# Altium project PCB-PRO.PrjPcb
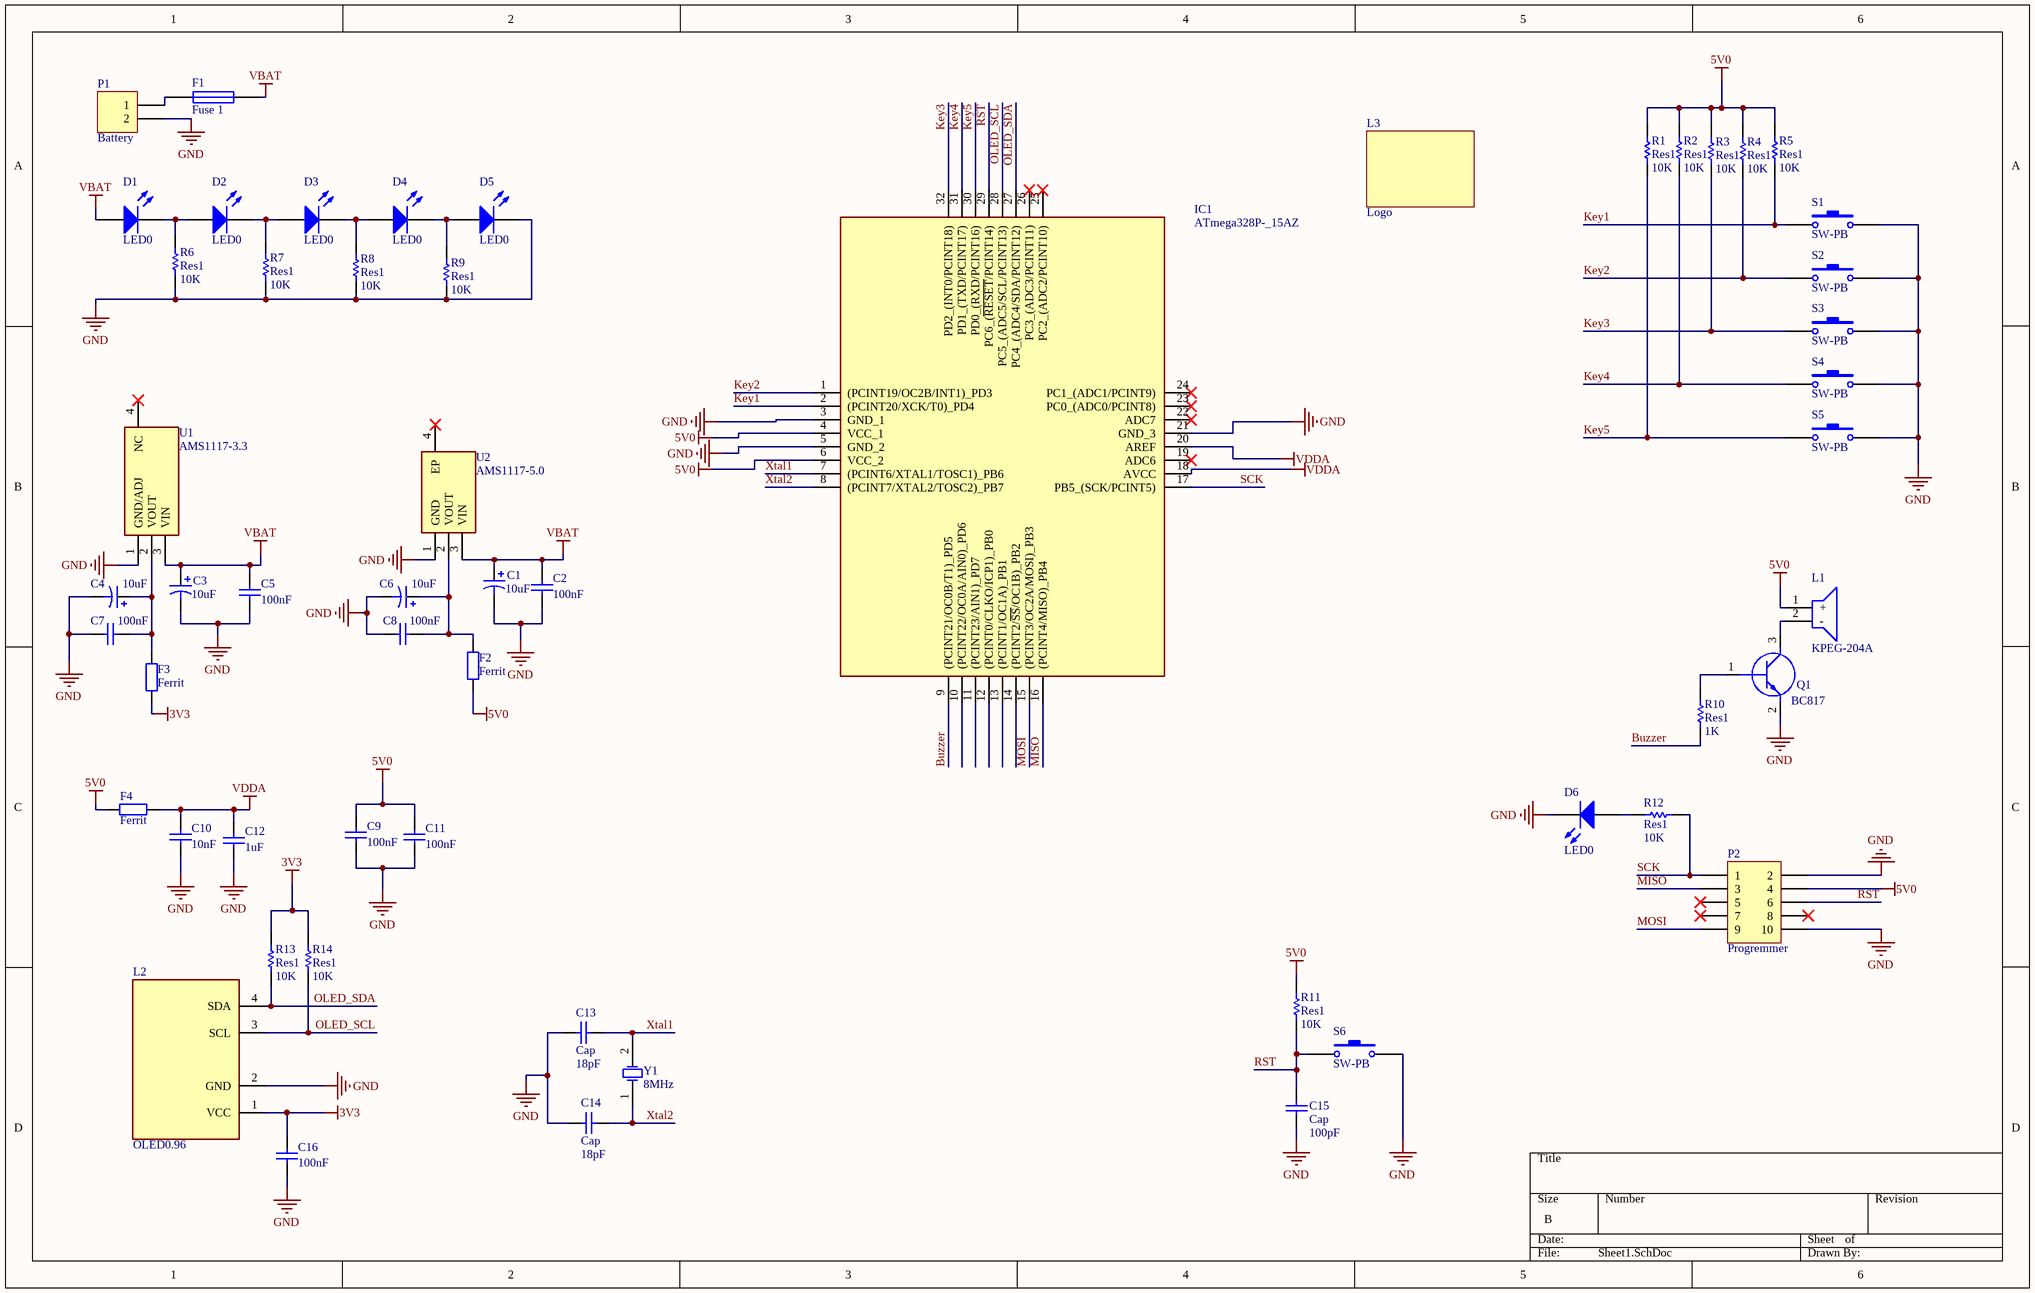
[diagram p0: Sheet1.SchDoc]
1 sheet, 56 parts. Net scope: global (net labels, ports and power ports of the same name join across sheets).
Board file: PCB1.PcbDoc

## Sheet Sheet1.SchDoc
size B; SheetNumber: 1; SheetTotal: 1; SPICEModelCacheSXCNOIOG: <root> / <DocumentId>SXCNOIOG</DocumentId> / <CacheFrame Number="0"> / <Model Name="xtal" Kind="CKT"> / <Text>*Generic type:crystal pkg:HC33/51 / .SUBCKT XTAL 1 2 PARAMS: FREQ=1Meg RS=750 C=13pf Q=1000 / LX 1 3 {((Q*RS)/(6.2831852*FREQ))} IC=0.5M / CX 3 4 {(1/(Q*6.2831852*FREQ*RS))} / C0 1 2 {C} / RS 4 2 {RS} / .ENDS XTAL</Text> / </Model> / <Model Name="fuse" Kind="CKT"> / <Text>.SUBCKT FUSE 1 2 PARAMS: CURRENT=1 RESISTANCE=1m / SW1 1 2 3 0 SMOD OFF / BNLV 3 0 V=(abs(v(1,2))) / .MODEL SMOD SW (VT={(CURRENT*RESISTANCE)} RON=1g ROFF={RESISTANCE}) / .ENDS FUSE</Text> / </Model> / <Model Name="led0" Kind="MDL"> / <Text>*Typ INFRARED GaAs LED: Vf=1.2V Vr=5V If=40mA trr=3uS / *LED Pinout: 1=A, 2=K / .MODEL LED0 D (IS=93.5P RS=84M N=2.63 BV=5 IBV=10U / + CJO=2.97P VJ=.75 M=.333 TT=4.32U)</Text> / </Model> / </CacheFrame> / </root>

### Parts
C1  value 10uF  [Tan-A]  (hidden comment: Cap Pol1)
C2  value 100nF  [603C]  (hidden comment: Cap)
C3  value 10uF  [Tan-A]  (hidden comment: Cap Pol1)
C4  value 10uF  [Tan-A]  (hidden comment: Cap Pol1)
C5  value 100nF  [603C]  (hidden comment: Cap)
C6  value 10uF  [Tan-A]  (hidden comment: Cap Pol1)
C7  value 100nF  [603C]  (hidden comment: Cap)
C8  value 100nF  [603C]  (hidden comment: Cap)
C9  value 100nF  [603C]  (hidden comment: Cap)
C10  value 10nF  [603C]  (hidden comment: Cap)
C11  value 100nF  [603C]  (hidden comment: Cap)
C12  value 1uF  [603C]  (hidden comment: Cap)
C13  Cap  value 18pF  [603C]
C14  Cap  value 18pF  [603C]
C15  Cap  value 100pF  [603C]
C16  value 100nF  [603C]  (hidden comment: Cap)
D1  LED0  [LED 0805]
D2  LED0  [LED 0805]
D3  LED0  [LED 0805]
D4  LED0  [LED 0805]
D5  LED0  [LED 0805]
D6  LED0  [LED 0603]
F1  Fuse 1  [Fuse 1206]
F2  Ferrit  [603FB]
F3  Ferrit  [603FB]
F4  Ferrit  [603FB]
IC1  ATmega328P-_15AZ  [ATMEGA328P-15AZ]
L1  KPEG-204A  [KPEG204A]
L2  OLED0.96  [OLED0.96]
L3  Logo  [Logo Abbas Lashgari]
P1  Battery  [XH-B2B]
P2  Progremmer  [IDC-2*5]
Q1  BC817  [BC817]
R1  Res1  value 10K  [603R]
R2  Res1  value 10K  [603R]
R3  Res1  value 10K  [603R]
R4  Res1  value 10K  [603R]
R5  Res1  value 10K  [603R]
R6  Res1  value 10K  [603R]
R7  Res1  value 10K  [603R]
R8  Res1  value 10K  [603R]
R9  Res1  value 10K  [603R]
R10  Res1  value 1K  [603R]
R11  Res1  value 10K  [603R]
R12  Res1  value 10K  [603R]
R13  Res1  value 10K  [603R]
R14  Res1  value 10K  [603R]
S1  SW-PB  [SW_2pin]
S2  SW-PB  [SW_2pin]
S3  SW-PB  [SW_2pin]
S4  SW-PB  [SW_2pin]
S5  SW-PB  [SW_2pin]
S6  SW-PB  [SW_2pin]
U1  AMS1117-3.3  [AMS1117-3.3]
U2  AMS1117-5.0  [AMS1117-5.0]
Y1  8MHz  [ABM3]

### Nets
3V3: C16.2 F3.1 L2.1(VCC) R13.2 R14.2
5V0: C9.2 C11.2 F2.1 F4.2 IC1.4(VCC_1) IC1.6(VCC_2) L1.1(+) P2.4 R1.2 R2.2 R3.2 R4.2 R5.2 R11.2
GND: C1.2 C2.1 C3.2 C4.2 C5.1 C6.2 C7.2 C8.2 C9.1 C10.1 C11.1 C12.1 C13.1 C14.1 C15.1 C16.1 D5.2(K) D6.2(K) IC1.3(GND_1) IC1.5(GND_2) IC1.21(GND_3) L2.2(GND) P1.2 P2.2 P2.10 Q1.2(E) R6.1 R7.1 R8.1 R9.1 S1.2 S2.2 S3.2 S4.2 S5.2 S6.2 U1.1(GND/ADJ) U2.1(GND)
VBAT: C1.1 C2.2 C3.1 C5.2 D1.1(A) F1.2 U1.3(VIN) U2.3(VIN)
VDDA: C10.2 C12.2 F4.1 IC1.18(AVCC) IC1.20(AREF)
Buzzer: IC1.9((PCINT21/OC0B/T1)_PD5) R10.2
Key1: IC1.2((PCINT20/XCK/T0)_PD4) R5.1 S1.1
Key2: IC1.1((PCINT19/OC2B/INT1)_PD3) R4.1 S2.1
Key3: IC1.32(PD2_(INT0/PCINT18)) R3.1 S3.1
Key4: IC1.31(PD1_(TXD/PCINT17)) R2.1 S4.1
Key5: IC1.30(PD0_(RXD/PCINT16)) R1.1 S5.1
MISO: IC1.16((PCINT4/MISO)_PB4) P2.3
MOSI: IC1.15((PCINT3/OC2A/MOSI)_PB3) P2.9
OLED_SCL: IC1.28(PC5_(ADC5/SCL/PCINT13)) L2.3(SCL) R14.1
OLED_SDA: IC1.27(PC4_(ADC4/SDA/PCINT12)) L2.4(SDA) R13.1
RST: C15.2 IC1.29(PC6_(~{RESET}/PCINT14)) P2.6 R11.1 S6.1
SCK: IC1.17(PB5_(SCK/PCINT5)) P2.1 R12.1
Xtal1: C13.2 IC1.7((PCINT6/XTAL1/TOSC1)_PB6) Y1.2(OSC2)
Xtal2: C14.2 IC1.8((PCINT7/XTAL2/TOSC2)_PB7) Y1.1(OSC1)
NetC4_1: C4.1 C7.1 F3.2 U1.2(VOUT)
NetC6_1: C6.1 C8.1 F2.2 U2.2(VOUT)
NetD1_2: D1.2(K) D2.1(A) R6.2
NetD2_2: D2.2(K) D3.1(A) R7.2
NetD3_2: D3.2(K) D4.1(A) R8.2
NetD4_2: D4.2(K) D5.1(A) R9.2
NetD6_1: D6.1(A) R12.2
NetF1_1: F1.1 P1.1
NetL1_2: L1.2(-) Q1.3(C)
NetQ1_1: Q1.1(B) R10.1

Not connected (* = marked no-connect by the designer): IC1 10((PCINT22/OC0A/AIN0)_PD6) 11((PCINT23/AIN1)_PD7) 12((PCINT0/CLKO/ICP1)_PB0) 13((PCINT1/OC1A)_PB1) 14((PCINT2/~{SS}/OC1B)_PB2) 19(ADC6)* 22(ADC7)* 23(PC0_(ADC0/PCINT8))* 24(PC1_(ADC1/PCINT9))* 25(PC2_(ADC2/PCINT10))* 26(PC3_(ADC3/PCINT11))*; P2 5* 7* 8*; U1 4(NC)*; U2 4(EP)*

### Library data of the parts
C1 C3 C4 C6 = Cap Pol1: Polarized Capacitor (Radial); Published: 8-Jun-2000; LatestRevisionDate: 17-Jul-2002; LatestRevisionNote: Re-released for DXP Platform.; PackageReference: RB7.6-15; Publisher: Altium Limited; PackageDescription: Polarized Capacitor (Radial); 2 Leads
C2 C5 C7-C16 = Cap: Capacitor; Published: 8-Jun-2000; LatestRevisionDate: 17-Jul-2002; LatestRevisionNote: Re-released for DXP Platform.; PackageReference: RAD-0.3; Publisher: Altium Limited; PackageDescription: Radial Cap, Thru-Hole; 2 Leads; 0.3 in Pin Spacing
D1-D6 = LED0: Typical INFRARED GaAs LED; Published: 8-Jun-2000; LatestRevisionDate: 08-Jul-2005; LatestRevisionNote: Mech Layer 1 removed.; PackageReference: LED-0; Publisher: Altium Limited; PackageDescription: LED; 2 Leads
F1 = Fuse 1: Fuse; Published: 8-Jun-2000; LatestRevisionDate: 17-Jul-2002; LatestRevisionNote: Re-released for DXP Platform.; PackageReference: PIN-W2/E2.8; Publisher: Altium Limited; PackageDescription: Thru-Hole; 2 Leads
F2-F4 = Res2: Resistor; Value: 1K; Published: 8-Jun-2000; LatestRevisionDate: 17-Jul-2002; LatestRevisionNote: Re-released for DXP Platform.; PackageReference: AXIAL-0.4; Publisher: Altium Limited; PackageDescription: Axial Device, Thru-Hole; 2 Leads; 0.4 in Pin Spacing
IC1 = ATmega328P_15AZ: AVR AVR® ATmega Microcontroller IC 8-Bit 16MHz 32KB (16K x 16) FLASH 32-TQFP (7x7); Manufacturer_Name: Microchip; Manufacturer_Part_Number: ATmega328P- 15AZ; Datasheet Link: https://ww1.microchip.com/downloads/en/DeviceDoc/Atmel-7810-Automotive-Microcontrollers-ATmega328P_Datasheet.pdf; Height: 1.2mm; Mouser Part Number: N/A; Mouser Price/Stock: https://www.mouser.com/Search/Refine.aspx?Keyword=N%2FA
L1 = KPEG-204A: Piezo Buzzers & Audio Indicators buzzer, 12 mm x 9.5 mm deep, M, 5 V, 85 dB, Through Hole, Audio Indicator; Manufacturer_Name: KINGSTATE; Datasheet Link: http://www.farnell.com/datasheets/16476.pdf; Height: 16.5mm; Manufacturer_Part_Number: KPEG-204A
L2 = OLED0.96: OLED 0.96 I2C
L3 = Logo: Abbas Lashgari Logo
P1 = Header 2: Header, 2-Pin; LatestRevisionDate: 17-Jul-2002; LatestRevisionNote: Re-released for DXP Platform.; Publisher: Altium Limited
P2 = Header 5X2: Header, 5-Pin, Dual row; LatestRevisionDate: 17-Jul-2002; LatestRevisionNote: Re-released for DXP Platform.; Publisher: Altium Limited
Q1 = BC817: 45 V, 500 mA NPN general-purpose transistors
R1-R14 = Res1: Resistor; Published: 8-Jun-2000; LatestRevisionDate: 17-Jul-2002; LatestRevisionNote: Re-released for DXP Platform.; PackageReference: AXIAL-0.3; Publisher: Altium Limited; PackageDescription: Axial Device, Thru-Hole; 2 Leads; 0.3 in Pin Spacing
S1-S6 = SW-PB: Switch; Published: 24-Mar-1999; LatestRevisionDate: 17-Jul-2002; LatestRevisionNote: Re-released for DXP Platform.; PackageReference: SPST-2; Publisher: Altium Limited; PackageDescription: Switch; 2 Leads
U1 = AMS1117-3.3: LDO Voltage Regulators 3.3V; Manufacturer_Name: Advanced; Datasheet Link: https://datasheet.datasheetarchive.com/originals/distributors/Datasheets-28/DSA-550594.pdf; Height: 1.8mm; Manufacturer_Part_Number: AMS1117-3.3
U2 = AMS1117-5.0: LDO Voltage Regulators 5.0V; Manufacturer_Name: Shikues; Datasheet Link: https://datasheet.lcsc.com/szlcsc/SK-AMS1117-5-0_C165483.pdf; Height: 1.8mm; Manufacturer_Part_Number: AMS1117-5.0
Y1 = XTAL: Crystal Oscillator; Published: 8-Jun-2000; LatestRevisionDate: 17-Jul-2002; LatestRevisionNote: Re-released for DXP Platform.; PackageReference: R38; Publisher: Altium Limited; PackageDescription: Crystal, Thru-Hole; 2 Leads; Body 3.1 x 8.2 mm (Dia.xH)